# EAGLE design hybrid (EAGLE 8.2.1)

## Sheet 1 of 3
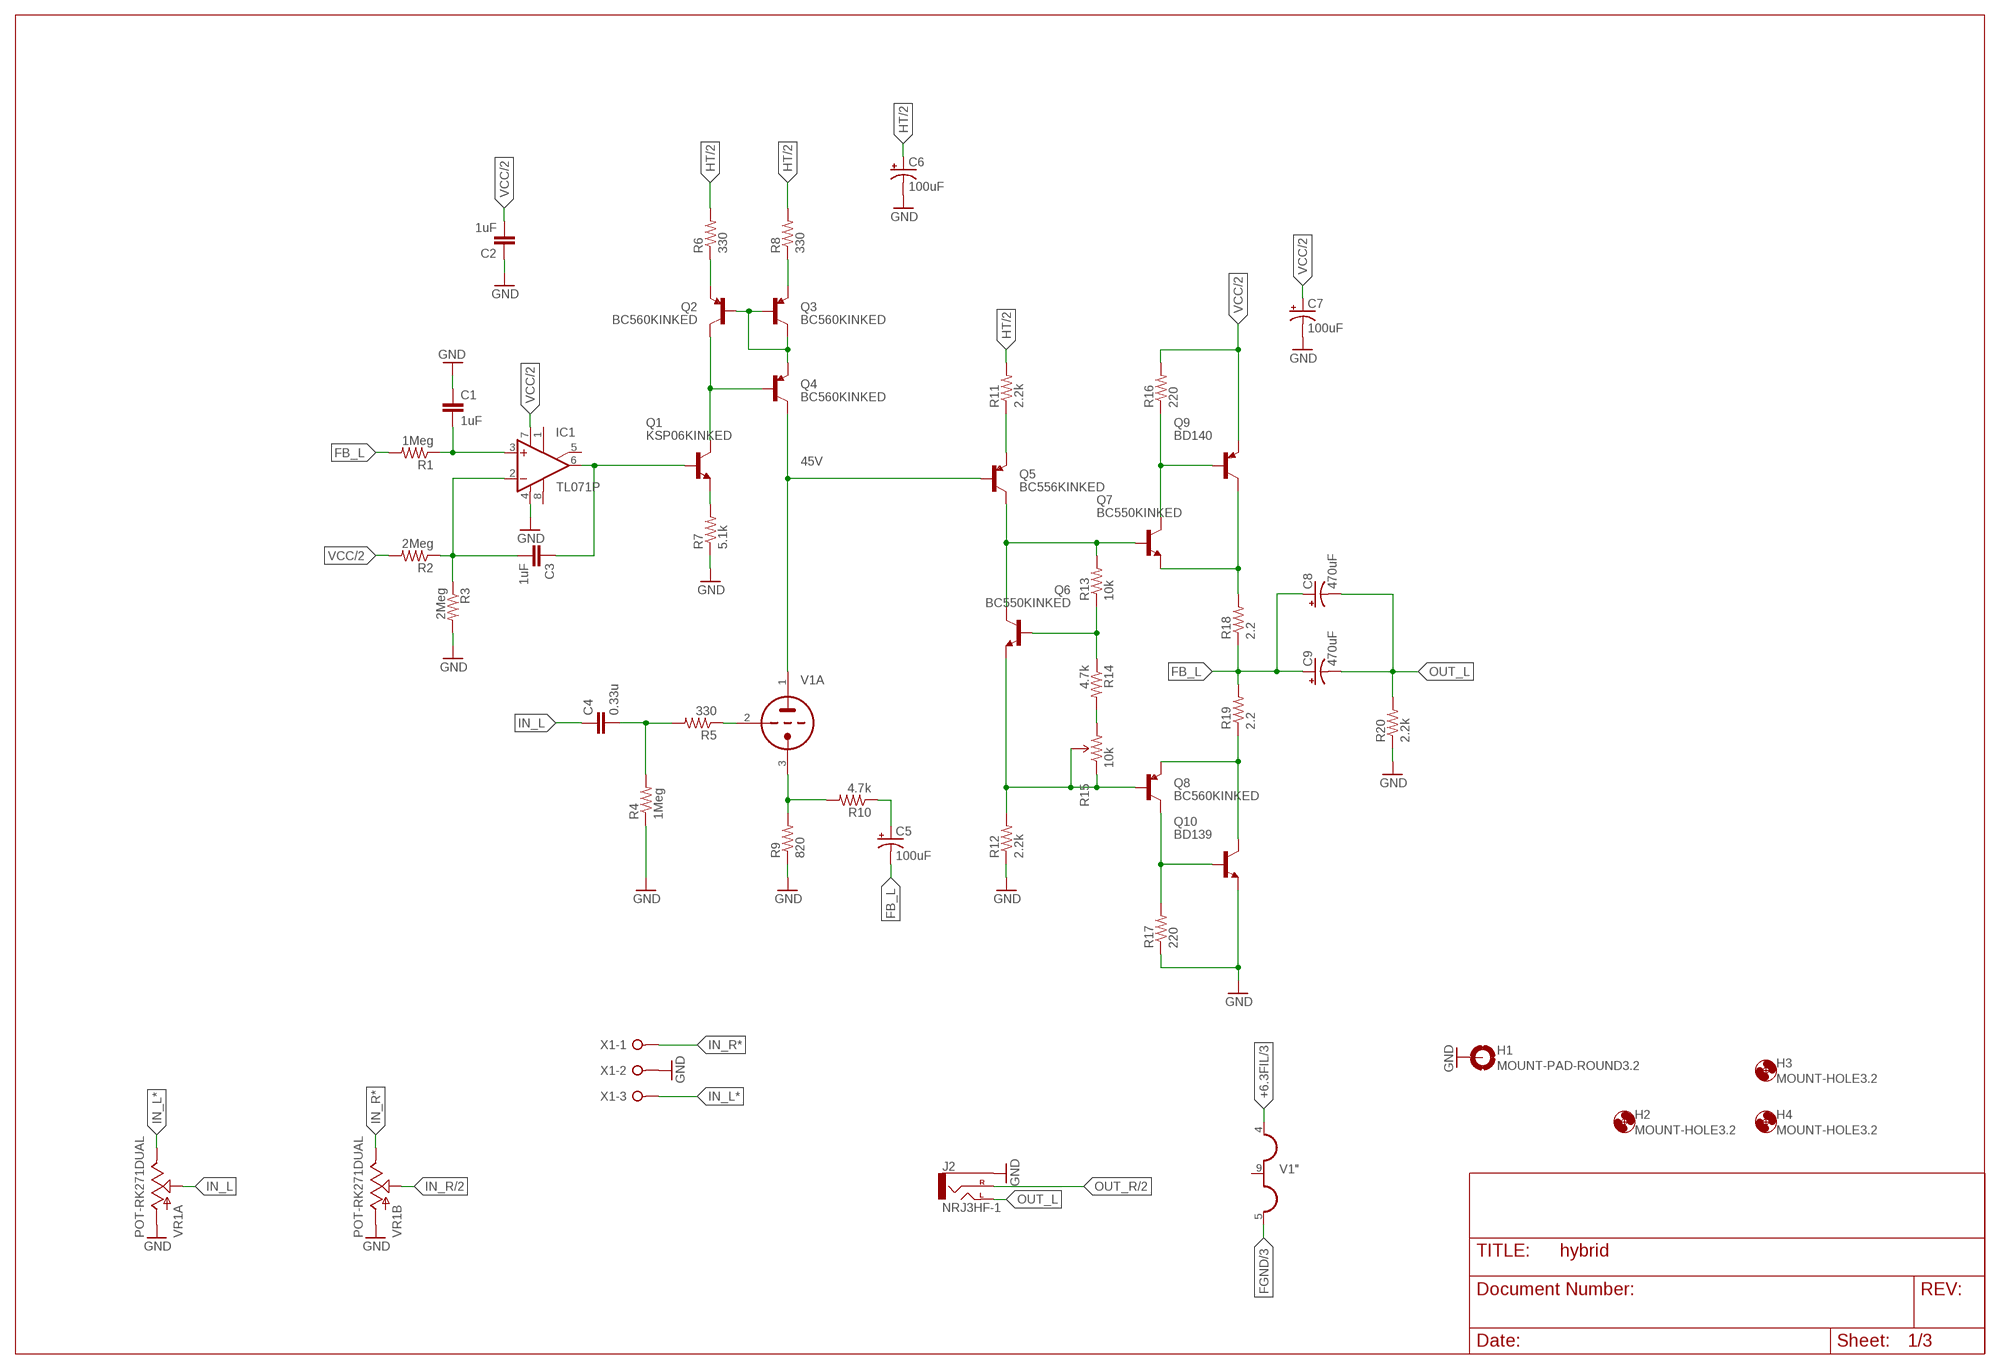
[diagram p0: schematic, sheet 1]

### Parts
C1  1uF  C5/5  [C5B5]
C2  1uF  CAPPTH  [CAP-PTH-SMALL]
C3  1uF  C5/5  [C5B5]
C4  0.33u  C5/7.2  [C5B7.2]
C5  100uF  CAP_POLPTH-8/3.5  [CPOL-RADIAL-8/3.5]
C6  100uF  CAP_POLPTH-12.5/5  [CPOL-RADIAL-12.5/5]
C7  100uF  CAP_POLPTH-12.5/5  [CPOL-RADIAL-12.5/5]
C8  470uF  CAP_POLPTH-12.5/5  [CPOL-RADIAL-12.5/5]
C9  470uF  CAP_POLPTH-12.5/5  [CPOL-RADIAL-12.5/5]
H1  MOUNT-PAD-ROUND3.2  [3,2-PAD]
H2  MOUNT-HOLE3.2  [3,2]
H3  MOUNT-HOLE3.2  [3,2]
H4  MOUNT-HOLE3.2  [3,2]
IC1  TL071P  [DIL08]
J2  NRJ3HF-1  [NRJ3HF]
Q1  KSP06KINKED  [TO92-BENT]
Q2  BC560KINKED  [TO92-BENT]
Q3  BC560KINKED  [TO92-BENT]
Q4  BC560KINKED  [TO92-BENT]
Q5  BC556KINKED  [TO92-BENT]
Q6  BC550KINKED  [TO92-BENT]
Q7  BC550KINKED  [TO92-BENT]
Q8  BC560KINKED  [TO92-BENT]
Q9  BD140  [TO126]
Q10  BD139  [TO126]
R1  1Meg  RESISTORPTH-1/4W  [AXIAL-0.4]
R2  2Meg  RESISTORPTH-1/4W  [AXIAL-0.4]
R3  2Meg  RESISTORPTH-1/4W  [AXIAL-0.4]
R4  1Meg  RESISTORPTH-1/4W  [AXIAL-0.4]
R5  330  RESISTORPTH-1/4W  [AXIAL-0.4]
R6  330  RESISTORPTH-1/4W  [AXIAL-0.4]
R7  5.1k  RESISTORPTH-1/4W  [AXIAL-0.4]
R8  330  RESISTORPTH-1/4W  [AXIAL-0.4]
R9  820  RESISTORPTH-1/4W  [AXIAL-0.4]
R10  4.7k  RESISTORPTH-1/4W  [AXIAL-0.4]
R11  2.2k  RESISTORPTH-1/4W  [AXIAL-0.4]
R12  2.2k  RESISTORPTH-1/4W  [AXIAL-0.4]
R13  10k  RESISTORPTH-1/4W  [AXIAL-0.4]
R14  4.7k  RESISTORPTH-1/4W  [AXIAL-0.4]
R15  10k  TRIMPOT3362U-2  [3362U-2]
R16  220  RESISTORPTH-1/4W  [AXIAL-0.4]
R17  220  RESISTORPTH-1/4W  [AXIAL-0.4]
R18  2.2  RESISTORPTH-1/4W  [AXIAL-0.4]
R19  2.2  RESISTORPTH-1/4W  [AXIAL-0.4]
R20  2.2k  RESISTORPTH-1/4W  [AXIAL-0.4]
V1  6DJ8-P21MM-BASE  [NOVAL-21MM]
VR1  POT-RK271DUAL  [RK271+PTD902]
X1  W237-3E  [W237-3E]

### Nets
+6.3FIL [pwr]: V1.4(":H1) ; also sheet 3
CAT_L: R9.P$2 R10.P$2 V1.3(A:TK)
FB_L [out]: C5.2(-) C8.+ C9.+ R1.P$2 R18.P$1 R19.P$2
FGND [pwr]: V1.5(":H3) ; also sheet 3
G_L: C4.2 R4.P$2 R5.P$2
GND: C1.1 C2.1 C6.- C7.- H1.B3,2(MOUNT) IC1.4(V-) J2.S(SLEEVE) Q10.1(E) R3.P$2 R4.P$1 R7.P$1 R9.P$1 R12.P$1 R17.P$1 R20.P$1 VR1.1.1.1(A:A) VR1.1.1.2(A:A) VR1.2.1.1(B:A) VR1.2.1.2(B:A) X1.2 ; also sheet 2,3
HT [pwr]: C6.+ R6.P$2 R8.P$2 R11.P$2 ; also sheet 2,3
IN_L: C4.1 VR1.1.2(A:S)
IN_L*: VR1.1.3.1(A:E) VR1.1.3.2(A:E) X1.3
IN_R: VR1.2.2.1(B:S) VR1.2.2.2(B:S) ; also sheet 2
IN_R*: VR1.2.3.1(B:E) VR1.2.3.2(B:E) X1.1
ISET_L: Q1.3(C) Q2.1(C) Q4.2(B)
N$1: Q2.2(B) Q3.1(C) Q3.2(B) Q4.3(E)
N$2: Q3.3(E) R8.P$1
N$3: Q2.3(E) R6.P$1
N$4: C5.1(+) R10.P$1
N$5: Q5.3(E) R11.P$1
N$6: R5.P$1 V1.2(A:TG)
N$7: Q5.1(C) Q6.1(C) Q7.2(B) R13.P$2
N$8: Q6.2(B) R13.P$1 R14.P$1
N$10: R14.P$2 R15.3(CW)
N$11 [out]: Q7.3(E) Q9.2(C) R18.P$2
N$12: Q6.3(E) Q8.2(B) R12.P$2 R15.1(CCW) R15.2(WIPER)
N$13 [out]: Q8.3(E) Q10.2(C) R19.P$1
N$14: Q7.1(C) Q9.3(B) R16.P$1
N$15: Q8.1(C) Q10.3(B) R17.P$2
N$29: C3.1 IC1.6(OUT) Q1.2(B)
N$35: C3.2 IC1.2(-IN) R2.P$1 R3.P$1
N$38: C1.2 IC1.3(+IN) R1.P$1
N$47: Q1.1(E) R7.P$2
OUT_L [out]: C8.- C9.- J2.T(LEFT) R20.P$2
OUT_R [out]: J2.R(RIGHT) ; also sheet 2
PL_L: Q4.1(C) Q5.2(B) V1.1(A:TA)
VCC [pwr]: C2.2 C7.+ IC1.7(V+) Q9.1(E) R2.P$2 R16.P$2 ; also sheet 2,3
Unconnected: IC1.1(ON1) IC1.5(ON2) IC1.8(OPT) V1.9(":H2)

### Notes on the sheet
- 45V

## Sheet 2 of 3
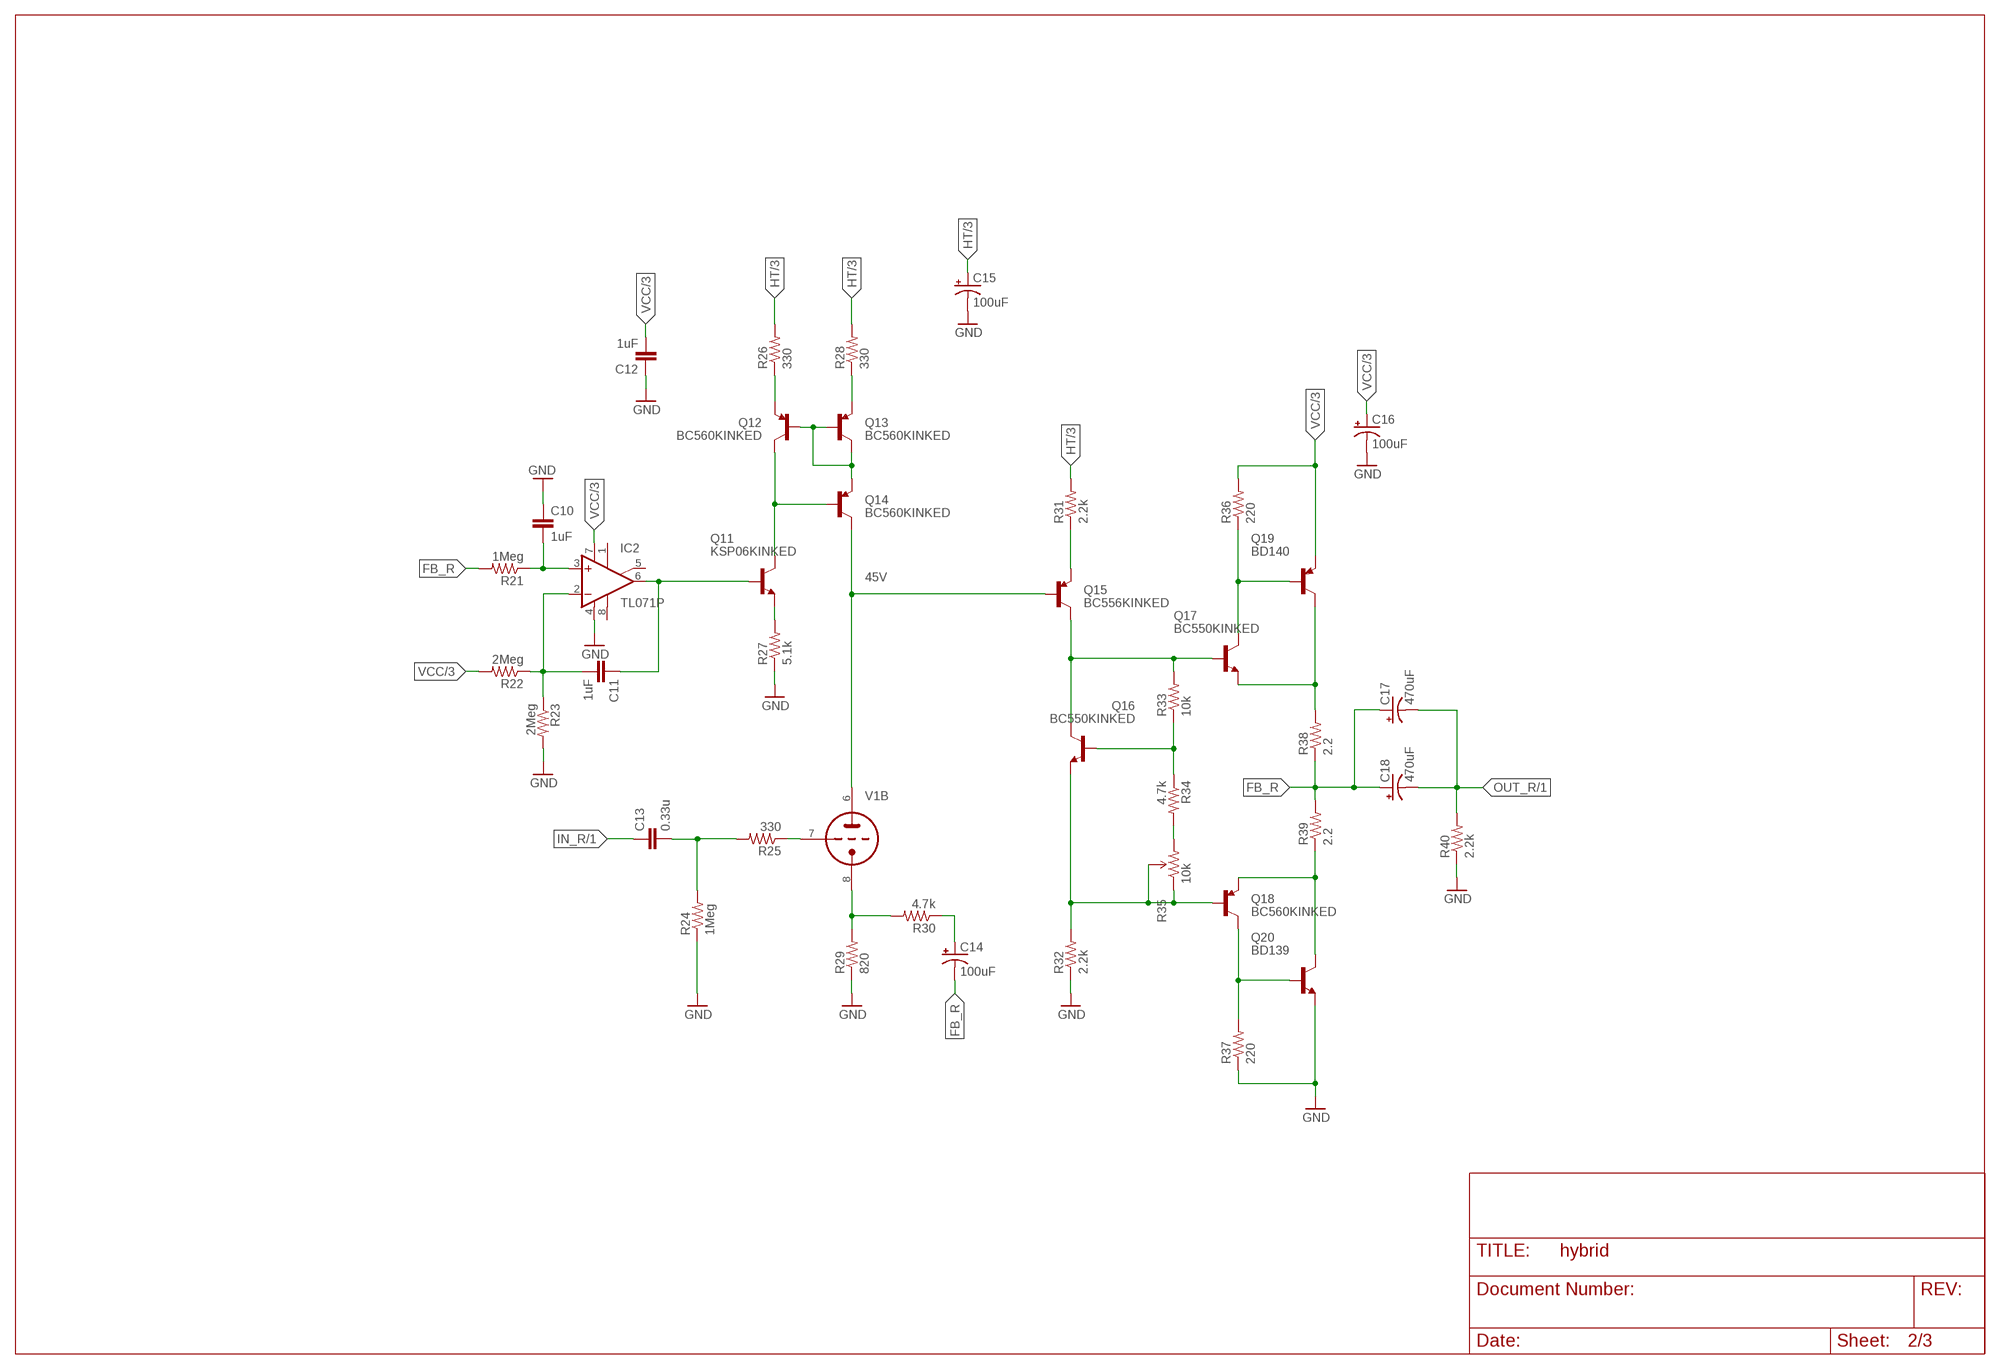
[diagram p1: schematic, sheet 2]

### Parts
C10  1uF  C5/5  [C5B5]
C11  1uF  C5/5  [C5B5]
C12  1uF  CAPPTH  [CAP-PTH-SMALL]
C13  0.33u  C5/7.2  [C5B7.2]
C14  100uF  CAP_POLPTH-8/3.5  [CPOL-RADIAL-8/3.5]
C15  100uF  CAP_POLPTH-12.5/5  [CPOL-RADIAL-12.5/5]
C16  100uF  CAP_POLPTH-12.5/5  [CPOL-RADIAL-12.5/5]
C17  470uF  CAP_POLPTH-12.5/5  [CPOL-RADIAL-12.5/5]
C18  470uF  CAP_POLPTH-12.5/5  [CPOL-RADIAL-12.5/5]
IC2  TL071P  [DIL08]
Q11  KSP06KINKED  [TO92-BENT]
Q12  BC560KINKED  [TO92-BENT]
Q13  BC560KINKED  [TO92-BENT]
Q14  BC560KINKED  [TO92-BENT]
Q15  BC556KINKED  [TO92-BENT]
Q16  BC550KINKED  [TO92-BENT]
Q17  BC550KINKED  [TO92-BENT]
Q18  BC560KINKED  [TO92-BENT]
Q19  BD140  [TO126]
Q20  BD139  [TO126]
R21  1Meg  RESISTORPTH-1/4W  [AXIAL-0.4]
R22  2Meg  RESISTORPTH-1/4W  [AXIAL-0.4]
R23  2Meg  RESISTORPTH-1/4W  [AXIAL-0.4]
R24  1Meg  RESISTORPTH-1/4W  [AXIAL-0.4]
R25  330  RESISTORPTH-1/4W  [AXIAL-0.4]
R26  330  RESISTORPTH-1/4W  [AXIAL-0.4]
R27  5.1k  RESISTORPTH-1/4W  [AXIAL-0.4]
R28  330  RESISTORPTH-1/4W  [AXIAL-0.4]
R29  820  RESISTORPTH-1/4W  [AXIAL-0.4]
R30  4.7k  RESISTORPTH-1/4W  [AXIAL-0.4]
R31  2.2k  RESISTORPTH-1/4W  [AXIAL-0.4]
R32  2.2k  RESISTORPTH-1/4W  [AXIAL-0.4]
R33  10k  RESISTORPTH-1/4W  [AXIAL-0.4]
R34  4.7k  RESISTORPTH-1/4W  [AXIAL-0.4]
R35  10k  TRIMPOT3362U-2  [3362U-2]
R36  220  RESISTORPTH-1/4W  [AXIAL-0.4]
R37  220  RESISTORPTH-1/4W  [AXIAL-0.4]
R38  2.2  RESISTORPTH-1/4W  [AXIAL-0.4]
R39  2.2  RESISTORPTH-1/4W  [AXIAL-0.4]
R40  2.2k  RESISTORPTH-1/4W  [AXIAL-0.4]

### Nets
CAT_R: R29.P$2 R30.P$2 V1.8(B:TK)
FB_R [out]: C14.2(-) C17.+ C18.+ R21.P$2 R38.P$1 R39.P$2
G_R: C13.2 R24.P$2 R25.P$2
GND: C10.1 C12.1 C15.- C16.- IC2.4(V-) Q20.1(E) R23.P$2 R24.P$1 R27.P$1 R29.P$1 R32.P$1 R37.P$1 R40.P$1 ; also sheet 1,3
HT [pwr]: C15.+ R26.P$2 R28.P$2 R31.P$2 ; also sheet 1,3
IN_R: C13.1 ; also sheet 1
ISET_R: Q11.3(C) Q12.1(C) Q14.2(B)
N$9: R25.P$1 V1.7(B:TG)
N$16: Q13.3(E) R28.P$1
N$17: Q12.2(B) Q13.1(C) Q13.2(B) Q14.3(E)
N$19: C14.1(+) R30.P$1
N$20: Q15.3(E) R31.P$1
N$21: Q15.1(C) Q16.1(C) Q17.2(B) R33.P$2
N$22: Q16.2(B) R33.P$1 R34.P$1
N$23: R34.P$2 R35.3(CW)
N$24: Q16.3(E) Q18.2(B) R32.P$2 R35.1(CCW) R35.2(WIPER)
N$25 [out]: Q17.3(E) Q19.2(C) R38.P$2
N$26 [out]: Q18.3(E) Q20.2(C) R39.P$1
N$27: Q17.1(C) Q19.3(B) R36.P$1
N$28: Q18.1(C) Q20.3(B) R37.P$2
N$39: Q12.3(E) R26.P$1
N$41: C11.2 IC2.2(-IN) R22.P$1 R23.P$1
N$42: C10.2 IC2.3(+IN) R21.P$1
N$43: C11.1 IC2.6(OUT) Q11.2(B)
N$48: Q11.1(E) R27.P$2
OUT_R [out]: C17.- C18.- R40.P$2 ; also sheet 1
PL_R: Q14.1(C) Q15.2(B) V1.6(B:TA)
VCC [pwr]: C12.2 C16.+ IC2.7(V+) Q19.1(E) R22.P$2 R36.P$2 ; also sheet 1,3
Unconnected: IC2.1(ON1) IC2.5(ON2) IC2.8(OPT)

### Notes on the sheet
- 45V

## Sheet 3 of 3
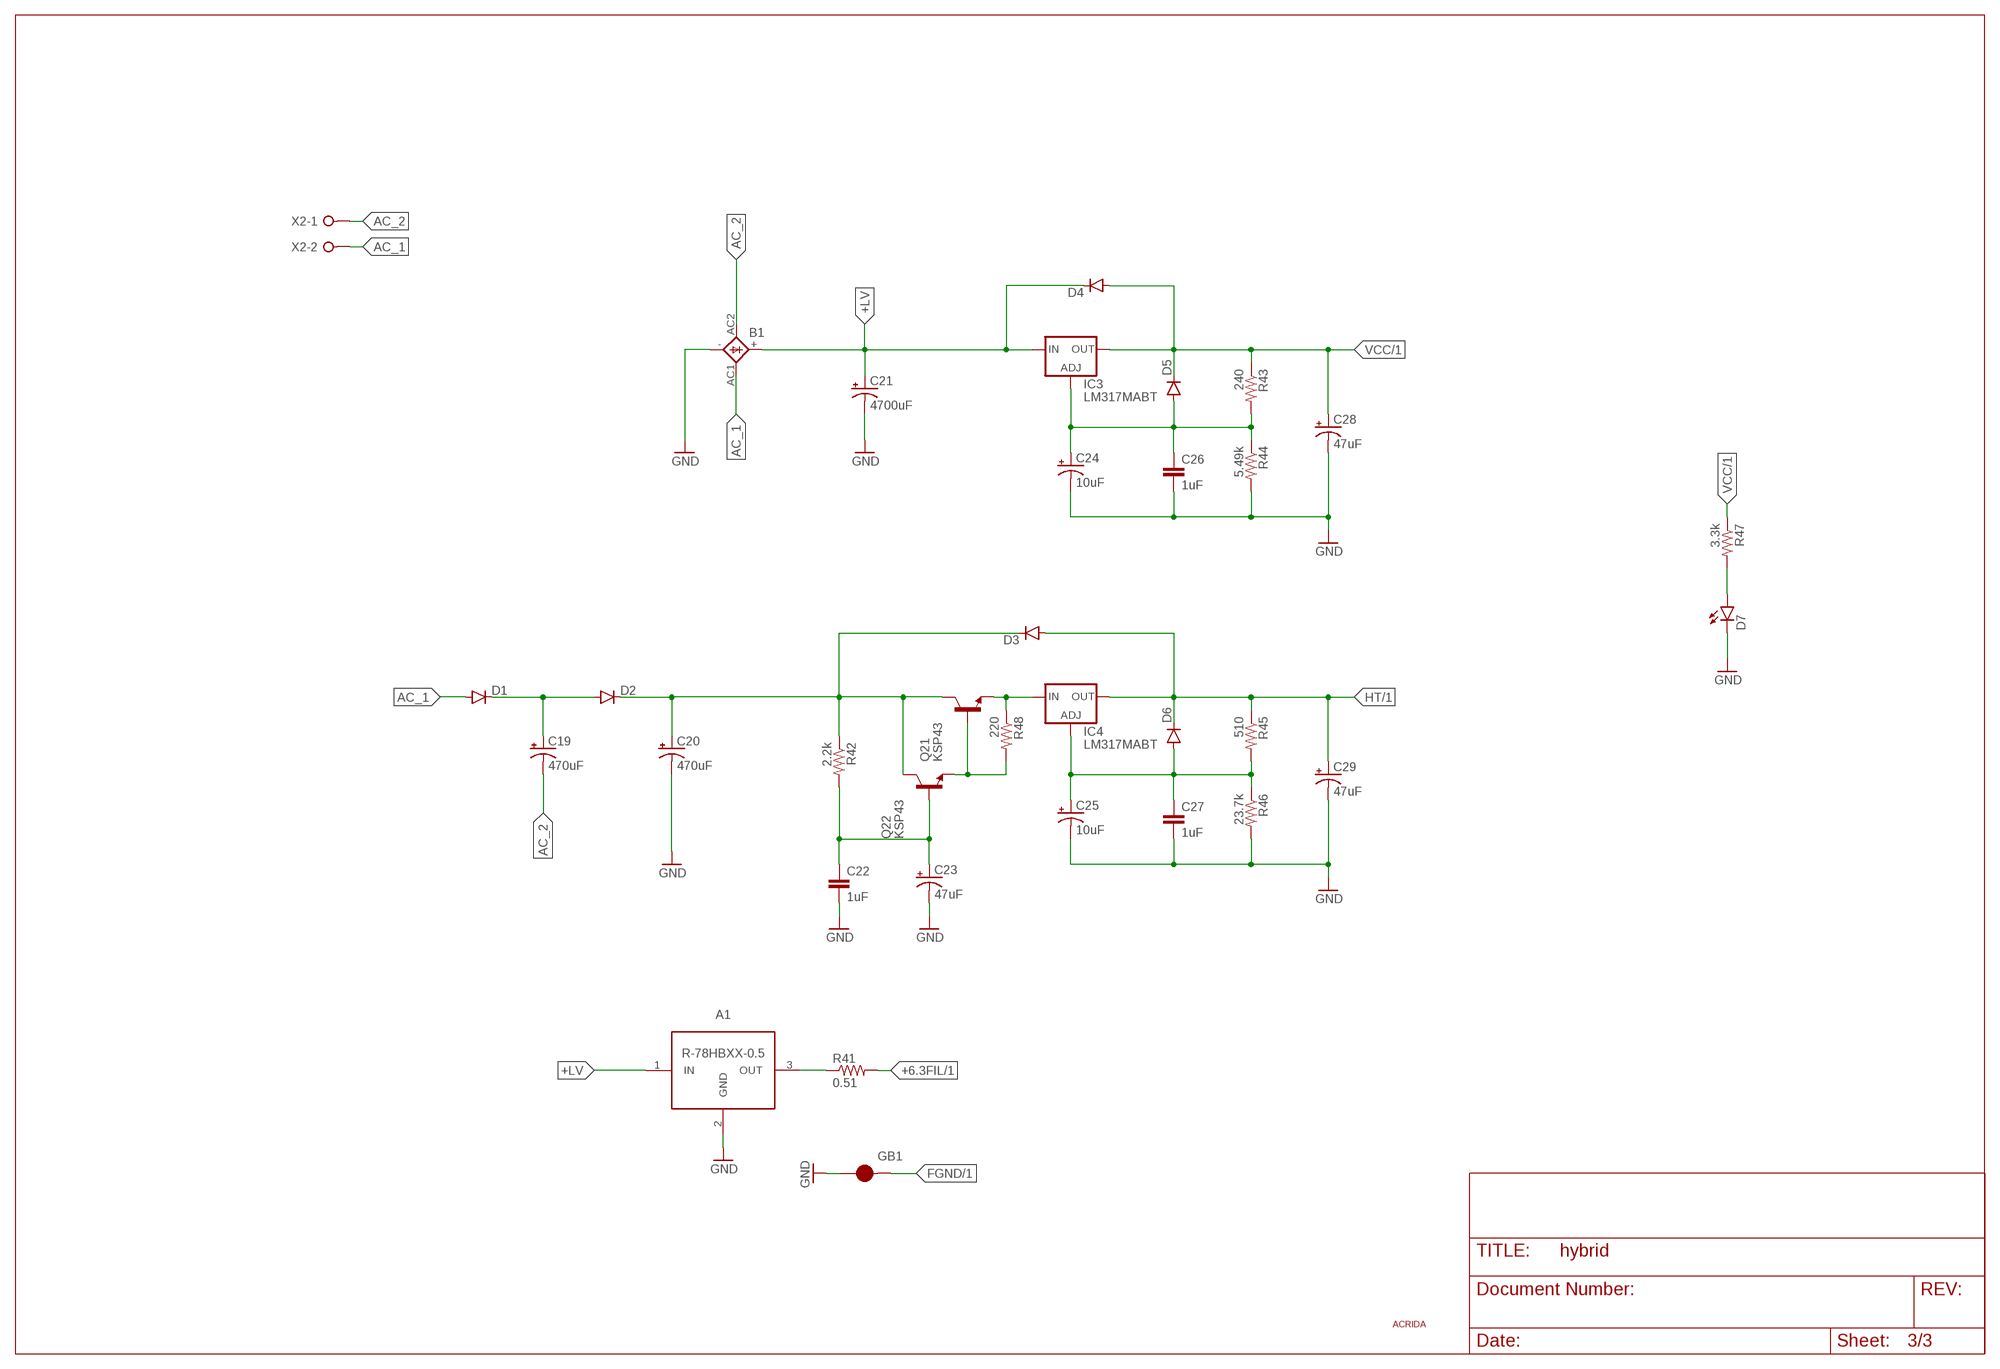
[diagram p2: schematic, sheet 3]

### Parts
A1  R-78HBXX-0.5  [R-78HB]
B1  GBU4  [GBU4S]
C19  470uF  CAP_POLPTH-18/7.5  [CPOL-RADIAL-18/7.5]
C20  470uF  CAP_POLPTH-18/7.5  [CPOL-RADIAL-18/7.5]
C21  4700uF  CAP_POLSNAPIN-30/10  [CPOL-SNAPIN-30/10]
C22  1uF  CAPPTH1  [CAP-PTH-5MM]
C23  47uF  CAP_POLPTH-12/5  [CPOL-RADIAL-12/5]
C24  10uF  CAP_POLPTH-5/2.5  [CPOL-RADIAL-5/2.5]
C25  10uF  CAP_POLPTH-6.5/2.5  [CPOL-RADIAL-6.5/2.5]
C26  1uF  CAPPTH  [CAP-PTH-SMALL]
C27  1uF  CAPPTH  [CAP-PTH-SMALL]
C28  47uF  CAP_POLPTH-8/3.5  [CPOL-RADIAL-8/3.5]
C29  47uF  CAP_POLPTH-8/3.5  [CPOL-RADIAL-8/3.5]
D1  DIODEPTH  [DIODE-1N4001]
D2  DIODEPTH  [DIODE-1N4001]
D3  DIODEPTH  [DIODE-1N4001]
D4  DIODEPTH  [DIODE-1N4001]
D5  DIODEPTH  [DIODE-1N4001]
D6  DIODEPTH  [DIODE-1N4001]
D7  LED3MM  [LED3MM]
GB1  COPPER-BRIDGESM  [COPPER-BRIDGE-SM]
IC3  LM317MABT  [TO220L1]
IC4  LM317MABT  [TO220L1]
LOGO1  ACRIDA-LOGO  [ACRIDA-LOGO]
Q21  KSP43  [TO-92]
Q22  KSP43  [TO-92]
R41  0.51  RESISTORPTH-1/2W  [AXIAL-0.5]
R42  2.2k  RESISTORPTH-1/4W  [AXIAL-0.4]
R43  240  RESISTORPTH-1/4W  [AXIAL-0.4]
R44  5.49k  RESISTORPTH-1/4W  [AXIAL-0.4]
R45  510  RESISTORPTH-1/4W  [AXIAL-0.4]
R46  23.7k  RESISTORPTH-1/4W  [AXIAL-0.4]
R47  3.3k  RESISTORPTH-1/4W  [AXIAL-0.4]
R48  220  RESISTORPTH-1/4W  [AXIAL-0.4]
X2  W237-2N  [W237-2N]

### Nets
+6.3FIL [pwr]: R41.P$2 ; also sheet 1
+LV [pwr]: A1.1(IN) B1.+ C21.1(+) D4.C IC3.3(IN)
AC_1: B1.AC1(AC2) D1.A X2.2
AC_2: B1.AC2(AC1) C19.2(-) X2.1
FGND [pwr]: GB1.2 ; also sheet 1
GND: A1.2(GND) B1.- C20.2(-) C21.2(-) C22.2 C23.- C24.2(-) C25.2(-) C26.2 C27.2 C28.2(-) C29.2(-) D7.K(C) GB1.1 R44.P$2 R46.P$2 ; also sheet 1,2
HT [pwr]: C29.1(+) D3.A D6.C IC4.2(OUT) R45.P$1 ; also sheet 1,2
N$18: Q21.2(B) Q22.1(E) R48.P$2
N$30: C24.1(+) C26.1 D5.A IC3.1(ADJ) R43.P$2 R44.P$1
N$31 [pwr]: C19.1(+) D1.C D2.A
N$32 [pwr]: A1.3(OUT) R41.P$1
N$33 [pwr]: C20.1(+) D2.C D3.C Q21.3(C) Q22.3(C) R42.P$1
N$34: C22.1 C23.+ Q22.2(B) R42.P$2
N$36: C25.1(+) C27.1 D6.A IC4.1(ADJ) R45.P$2 R46.P$1
N$37 [pwr]: IC4.3(IN) Q21.1(E) R48.P$1
N$46: D7.A R47.P$2
VCC [pwr]: C28.1(+) D4.A D5.C IC3.2(OUT) R43.P$1 R47.P$1 ; also sheet 1,2

## Library data of the parts
A1 = my-smps:R-78HBXX-0.5: The R-78HBxx-Series high efficiency, high input voltage switching regulators are ideally suited to replace 78xx linear regulators and are pin compatible. http://www.mouser.com/ds/2/468/R-78HBxx-0.5_L-958370.pdf
B1 = rectifier:GBU4: GENERAL INSTRUMENT RECTIFIER
C1 C3 C4 C10 C11 C13 = capacitor-wima:C: CAPACITOR naming: grid - package width
C2 C12 C22 C26 C27 = SparkFun-Capacitors:CAP: Capacitor Standard 0603 ceramic capacitor, and 0.1" leaded capacitor.
C5-C9 C14-C21 C23-C25 C28 C29 = my-cap:CAP_POL: Capacitor Polarized These are standard SMD and PTH capacitors. Normally 10uF, 47uF, and 100uF in electrolytic and tantalum varieties. Always verify the external diameter of the through hole cap, it varies with capacity, voltage, and manufacturer. The EIA devices should be standard.
D1-D6 = SparkFun-DiscreteSemi:DIODE: Diode These are standard reverse protection diodes and small signal diodes. SMA package can handle up to about 1A. SOD-323 can handle about 200mA. What the SOD-323 package when ordering, there are some mfgs out there that are 5-pin packages.
D7 = SparkFun-LED:LED: LEDs Standard schematic elements and footprints for 5mm, 3mm, 1206, and 0603 sized LEDs. 5mm - Spark Fun Electronics SKU : COM-00529 (and others); PROD_ID: DIO-08794
GB1 = my:COPPER-BRIDGE
H1 = holes:MOUNT-PAD-ROUND: MOUNTING PAD, round
H2-H4 = holes:MOUNT-HOLE: MOUNTING HOLE with drill center marker
IC1 IC2 = linear:TL071: OP AMP
IC3 IC4 = my-reg:LM317?*: 500 mA Adjustable Output Positive Voltage Regulator Source: http://www.onsemi.co.jp .. LM317M-D.PDF
J2 = my-conn:NRJ3HF-1: 1/4" Phone Jack
LOGO1 = my-logo:ACRIDA-LOGO
Q1 Q11 = my-tran:KSP06: NPN Epitaxial Silicon Transistor
Q2-Q4 Q8 Q12-Q14 Q18 = my-tran:BC560
Q5 Q15 = my-tran:BC556
Q6 Q7 Q16 Q17 = my-tran:BC550: NPN Epitaxial Silicon Transistor
Q9 Q19 = transistor-pnp:BD140: PNP Transistor
Q10 Q20 = transistor-npn:BD139*: NPN Transistor
Q21 Q22 = my-tran:KSP43
R1-R14 R16-R34 R36-R40 R42-R48 = SparkFun-Resistors:RESISTOR: Resistor Basic schematic elements and footprints for 0603, 1206, and PTH resistors.
R15 R35 = SparkFun-Electromechanical:TRIMPOT: Various small potentiometers for "set-and-forget" applications
R41 = my-res:RESISTOR: Resistor Basic schematic elements and footprints for 0603, 1206, and PTH resistors.
V1 = my-tubes:6DJ8-P
VR1 = my:POT-RK271: 27mm Size Metal Shaft Type RK271 Series Rotary Potentiometer
X1 = con-wago-508:W237-3E: WAGO SREW CLAMP; OC_FARNELL: unknown; OC_NEWARK: unknown
X2 = con-wago-508:W237-2N: WAGO SREW CLAMP; OC_FARNELL: unknown; OC_NEWARK: unknown

## Net classes
1 out: width 0.813 mm
2 pwr: width 1.27 mm

## Board
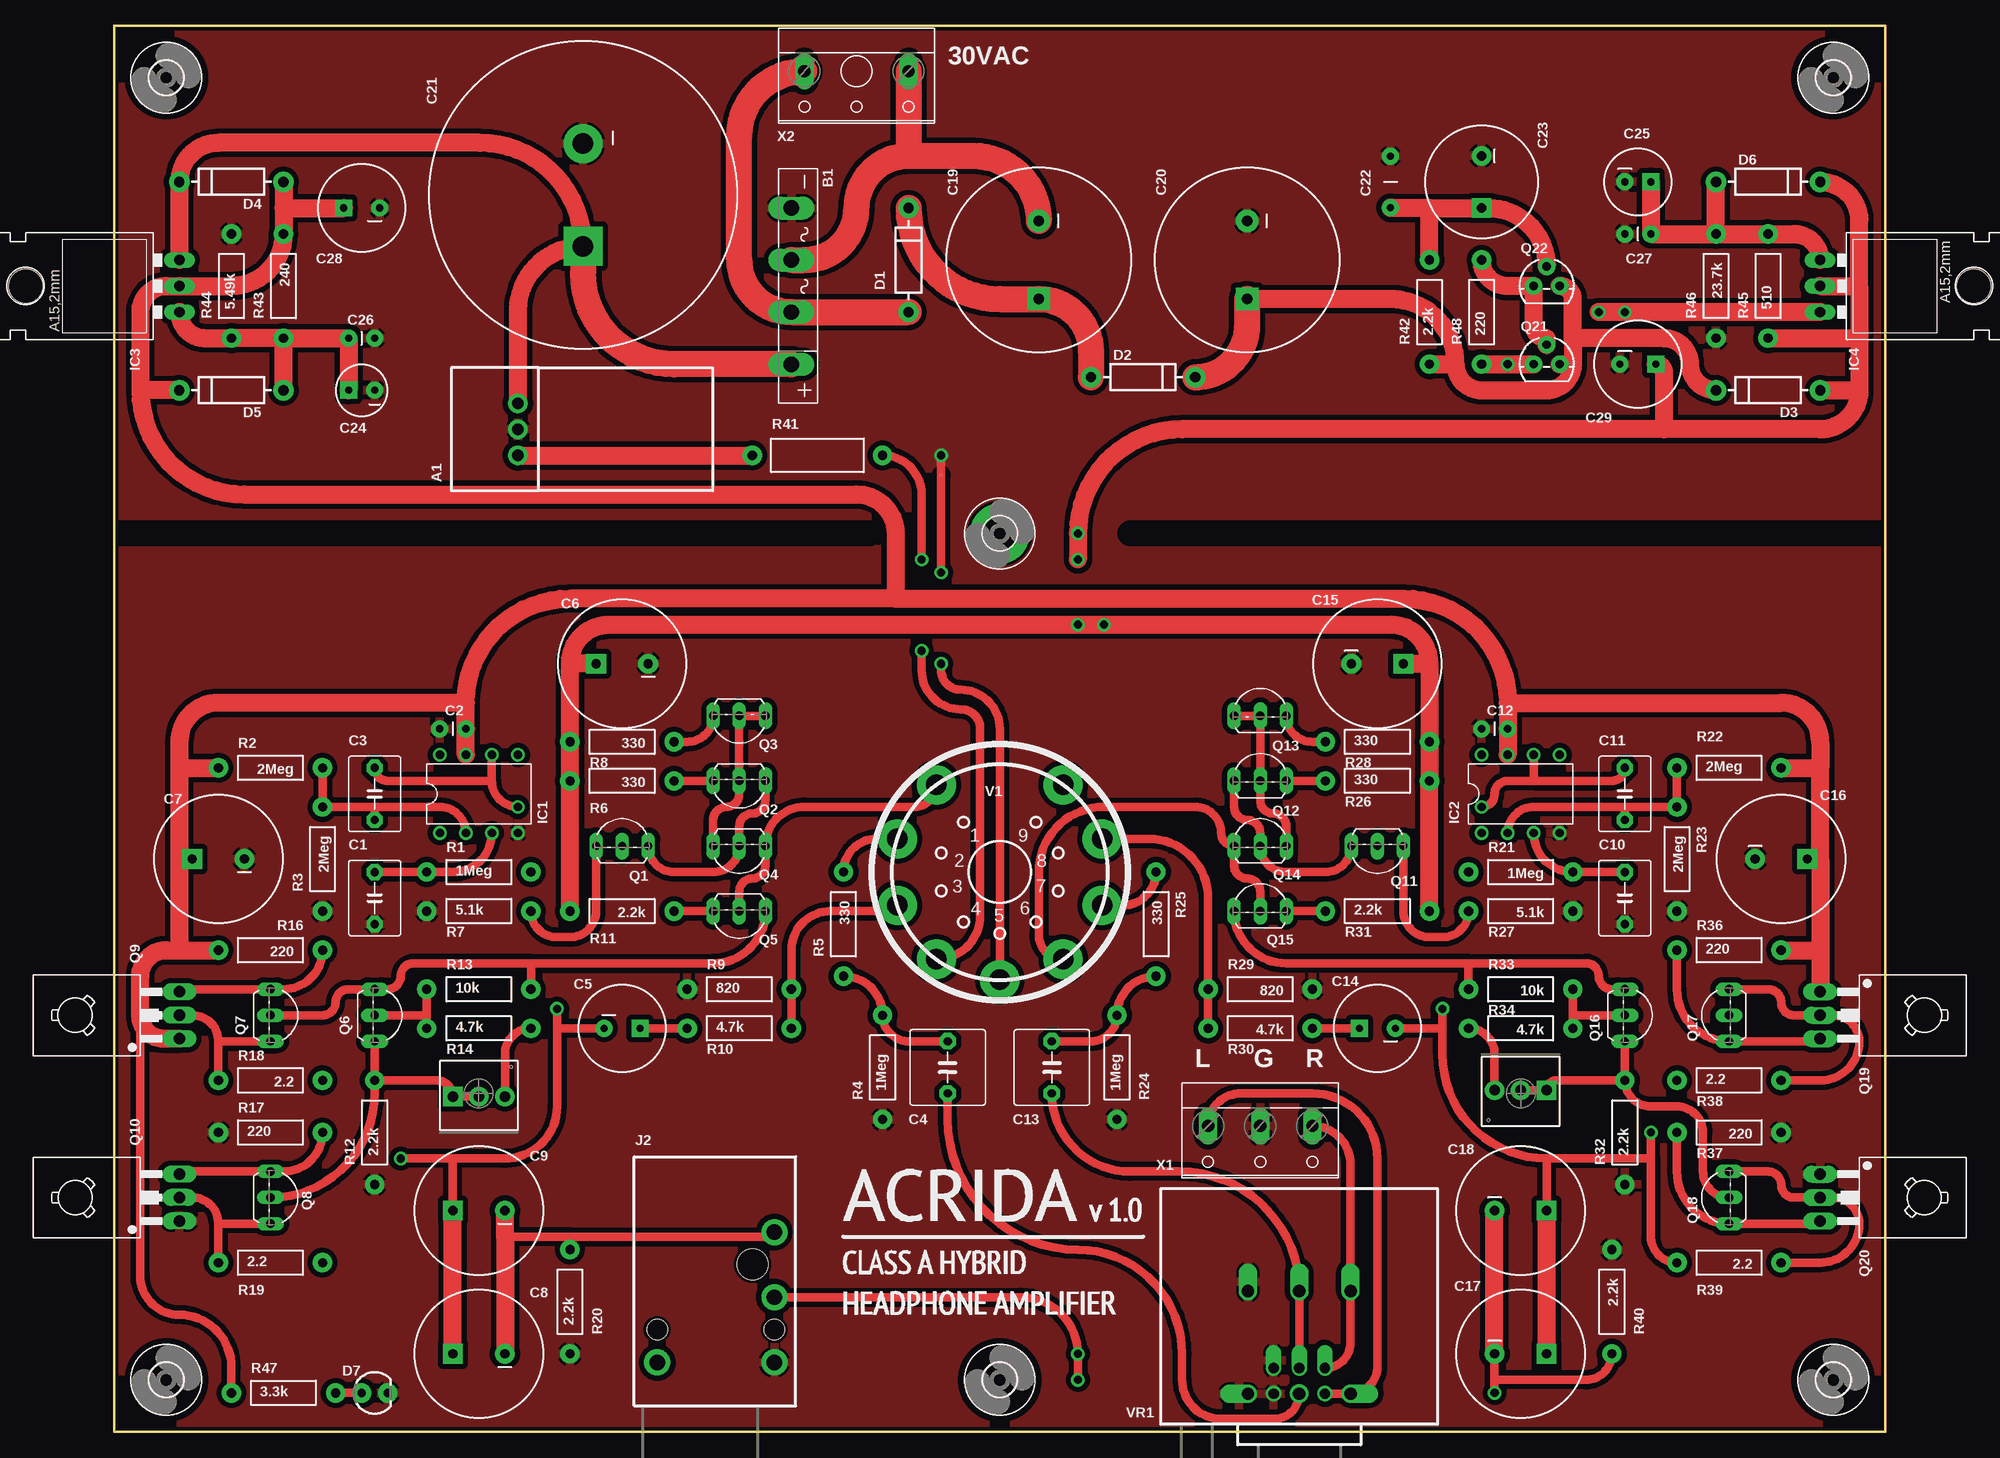
[diagram p3: board, top side]
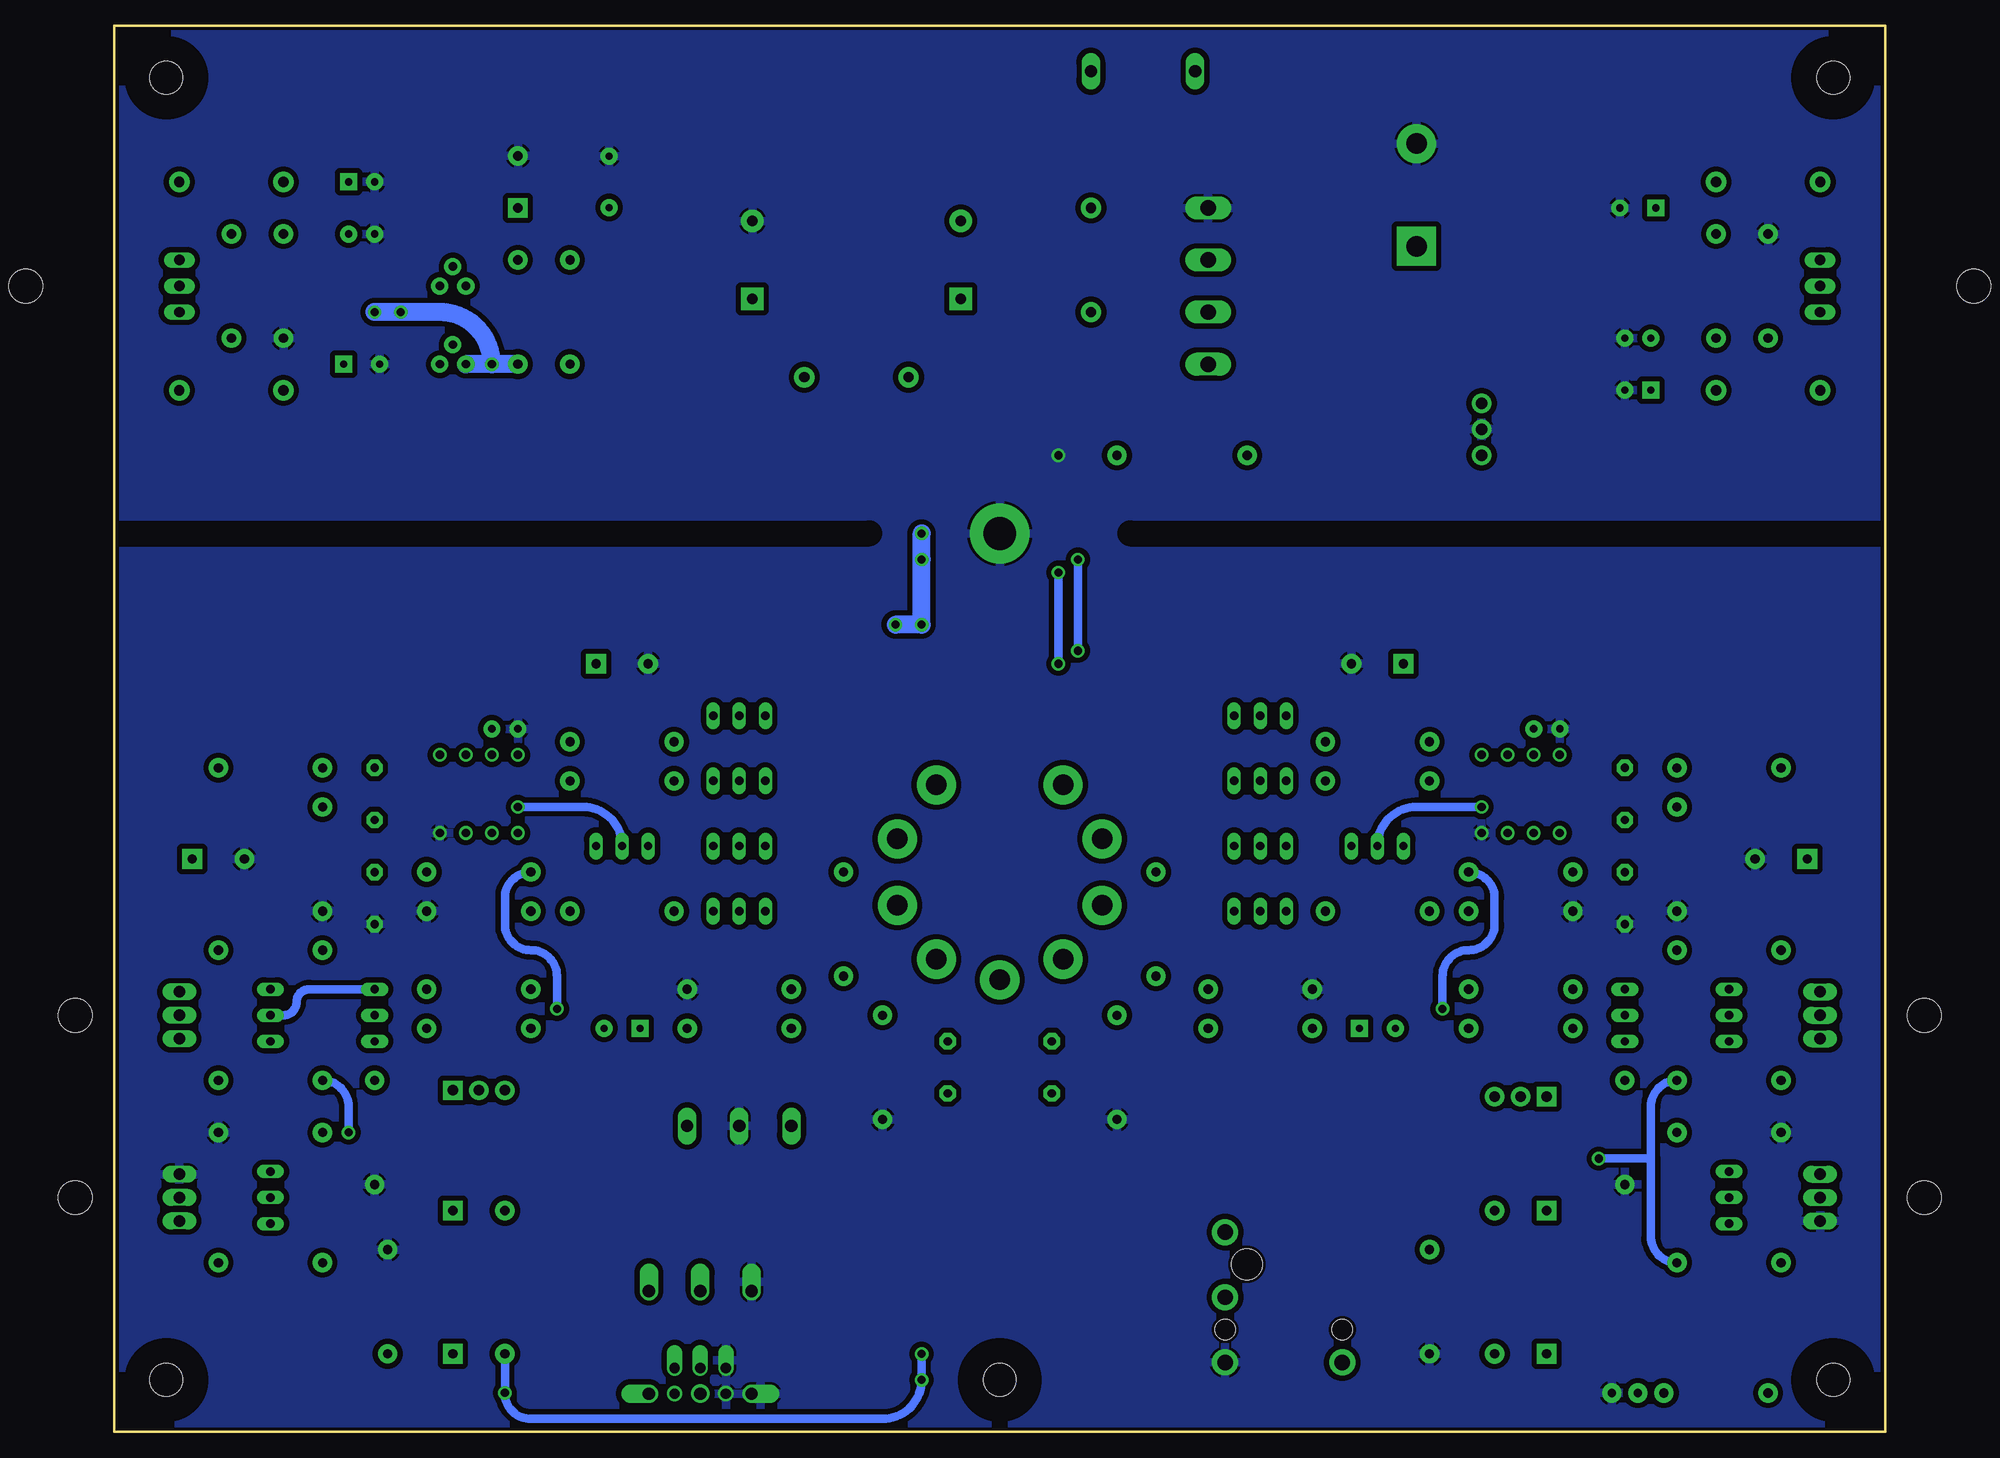
[diagram p4: board, bottom side, seen from below]

Size 172.72 x 137.16 mm. Coordinates in mm from the lower left corner, seen from the top.
Outline: 172.72,137.16 172.72,0 0,0 0,137.16 172.72,137.16
Copper layers (1*16): Top 0.035mm / dielectric 1.5mm / Bottom 0.035mm
Design rules "SeeedStudio_2layer_DRU_no_angle_20140221 *": minimum track width 12mil, minimum drill 12mil, track to track 20mil, track to pad 20mil, pad to pad 20mil, via to via 20mil, smd to smd 0mil, copper to edge 12mil, drill to drill 12mil, minimum pad ring 10mil, minimum via ring 10mil, stop-mask expansion 2mil, vias tented up to drill 100mil, thermal gap 10mil
tRestrict: 2 lines
bRestrict: 2 lines

### Footprints (pad centres in the part's own frame; a part is rotated, then mirrored left to right if it is on the bottom)
R-78HB = drill 1.1 pad 1.93: 1 -2.54,0; 2 0,0; 3 2.54,0
GBU4S = drill 1.499 long: + 7.62,0; - -7.62,0; AC1 2.54,0; AC2 -2.54,0
C5B5 = drill 0.813 pad 1.6 octagon: 1 -2.54,0; 2 2.54,0
CAP-PTH-SMALL = drill 0.7 pad 1.651: 1 0,0; 2 2.54,0
C5B7.2 = drill 0.813 pad 1.6 octagon: 1 -2.54,0; 2 2.54,0
CPOL-RADIAL-8/3.5 = drill 0.7 pad 1.651 square: 1 1.75,0 | drill 0.7 pad 1.651: 2 -1.75,0
CPOL-RADIAL-12.5/5 = drill 0.9 pad 1.93 square: + 2.54,0 | drill 0.9 pad 1.93: - -2.54,0
CPOL-RADIAL-18/7.5 = drill 1.016 pad 2.184 square: 1 3.81,0 | drill 1.016 pad 2.184: 2 -3.81,0
CPOL-SNAPIN-30/10 = drill 2 pad 3.81 square: 1 5,0 | drill 2 pad 3.81: 2 -5,0
CAP-PTH-5MM = drill 0.7 pad 1.651: 1 -2.5,0; 2 2.5,0
CPOL-RADIAL-12/5 = drill 0.9 pad 1.93 square: + 2.54,0 | drill 0.9 pad 1.93: - -2.54,0
CPOL-RADIAL-5/2.5 = drill 0.7 pad 1.651 square: 1 1.27,0 | drill 0.7 pad 1.651: 2 -1.27,0
CPOL-RADIAL-6.5/2.5 = drill 0.7 pad 1.651 square: 1 1.27,0 | drill 0.7 pad 1.651: 2 -1.27,0
DIODE-1N4001 = drill 1 pad 1.981: A -5.08,0; C 5.08,0
LED3MM = drill 0.813 pad 1.88: A -1.27,0; K 1.27,0
COPPER-BRIDGE-SM = smd 0.203 x 0.203: 1 0,0; 2 0,0
3,2-PAD = drill 3.2 pad 5.842: B3,2 0,0
3,2 = hole 3.2: 0,0
DIL08 = drill 0.813 pad 1.27: 1 -3.81,-3.81; 2 -1.27,-3.81; 3 1.27,-3.81; 4 3.81,-3.81; 5 3.81,3.81; 6 1.27,3.81; 7 -1.27,3.81; 8 -3.81,3.81
TO220L1 = drill 1.016 long: 1 -2.54,-3.81; 2 0,-3.81; 3 2.54,-3.81 | hole 3.302: 0,11.176
NRJ3HF = drill 1.5 pad 2.54: G -4.25,-4.2; R -10.6,7.23; S -4.25,7.23; T -16.95,7.23 | hole 2: -7.45,7.23; -7.45,-4.2 | hole 3: -13.8,5.1
TO92-BENT = drill 0.813 long: 1 -2.54,-1.27; 2 0,-1.27; 3 2.54,-1.27
TO126 = drill 1.118 long: 1 -2.286,-5.08; 2 0,-5.08; 3 2.286,-5.08 | hole 3.302: 0,5.08
TO-92 = drill 0.813 pad 1.676: 1 -1.27,0; 2 0,1.905; 3 1.27,0
AXIAL-0.4 = drill 0.9 pad 1.88: P$1 -5.08,0; P$2 5.08,0
3362U-2 = drill 1.016 pad 1.88 square: 1 -2.54,-0.305 | drill 1.016 pad 1.88: 2 0,-0.305; 3 2.54,-0.305
AXIAL-0.5 = drill 0.9 pad 1.88: P$1 -6.35,0; P$2 6.35,0
NOVAL-21MM = drill 2 pad 3.81: 1 6.172,-8.495; 2 9.986,-3.245; 3 9.986,3.245; 4 6.172,8.495; 5 0,10.5; 6 -6.172,8.495; 7 -9.986,3.245; 8 -9.986,-3.245; 9 -6.172,-8.495
RK271+PTD902 = drill 1.2 offset: 1.1.1 -5,-5; 1.3.1 -5,5; 2.1.1 -15,-5; 2.2.1 -15,0; 2.3.1 -15,5 | drill 1: 1.1.2 -5,-2.5; 1.3.2 -5,2.5 | drill 1.2: 1.2 -5,0 | drill 1 offset: 2.1.2 -7.5,-2.5; 2.2.2 -7.5,0; 2.3.2 -7.5,2.5
W237-3E = drill 1.194 long: 1 -5.08,-0.635; 2 0,-0.635; 3 5.08,-0.635
W237-2N = drill 1.194 long: 1 -5.08,-0.635; 2 5.08,-0.635

### Placement (x,y rotation side)
A1  39.37,97.79 270 top
B1  66.04,111.76 270 top
C1  25.4,52.07 90 top
C2  31.75,68.58 0 top
C3  25.4,62.23 270 top
C4  81.28,35.56 90 top
C5  49.53,39.37 0 top
C6  49.53,74.93 180 top
C7  10.16,55.88 180 top
C8  35.56,7.62 180 top
C9  35.56,21.59 180 top
C10  147.32,52.07 90 top
C11  147.32,62.23 270 top
C12  133.35,68.58 0 top
C13  91.44,35.56 90 top
C14  123.19,39.37 180 top
C15  123.19,74.93 0 top
C16  162.56,55.88 0 top
C17  137.16,7.62 0 top
C18  137.16,21.59 0 top
C19  90.17,114.3 270 top
C20  110.49,114.3 270 top
C21  45.72,120.65 270 top
C22  124.46,121.92 90 top
C23  133.35,121.92 270 top
C24  24.13,101.6 180 top
C25  148.59,121.92 0 top
C26  22.86,106.68 0 top
C27  149.86,116.84 180 top
C28  24.13,119.38 180 top
C29  148.59,104.14 0 top
D1  77.47,114.3 90 top
D2  100.33,102.87 0 top
D3  161.29,101.6 180 top
D4  11.43,121.92 180 top
D5  11.43,101.6 180 top
D6  161.29,121.92 0 top
D7  25.4,3.81 0 top
GB1  80.64,93.34 0 top
H1  86.36,87.63 0 top
H2  86.36,5.08 0 top
H3  167.64,5.08 0 top
H4  5.08,5.08 0 top
H5  MOUNT-HOLE3.2  [3,2]  5.08,132.08 0 top
H6  MOUNT-HOLE3.2  [3,2]  167.64,132.08 0 top
IC1  35.56,62.23 0 top
IC2  137.16,62.23 0 top
IC3  2.54,111.76 90 top
IC4  170.18,111.76 270 top
J2  57.15,2.54 270 top
LOGO1  71.12,11.43 0 top
Q1  49.53,58.42 0 top
Q2  60.96,62.23 180 top
Q3  60.96,68.58 180 top
Q4  60.96,55.88 180 top
Q5  60.96,49.53 180 top
Q6  26.67,40.64 270 top
Q7  16.51,40.64 270 top
Q8  16.51,22.86 270 top
Q9  1.27,40.64 90 top
Q10  1.27,22.86 90 top
Q11  123.19,55.88 180 top
Q12  111.76,64.77 0 top
Q13  111.76,71.12 0 top
Q14  111.76,58.42 0 top
Q15  111.76,52.07 0 top
Q16  148.59,40.64 270 top
Q17  156.21,40.64 90 top
Q18  156.21,22.86 90 top
Q19  171.45,40.64 270 top
Q20  171.45,22.86 270 top
Q21  139.7,104.14 0 top
Q22  139.7,111.76 0 top
R1  35.56,54.61 0 top
R2  15.24,64.77 180 top
R3  20.32,55.88 270 top
R4  74.93,35.56 90 top
R5  71.12,49.53 270 top
R6  49.53,63.5 180 top
R7  35.56,50.8 0 top
R8  49.53,67.31 180 top
R9  60.96,43.18 0 top
R10  60.96,39.37 0 top
R11  49.53,50.8 180 top
R12  25.4,29.21 90 top
R13  35.56,43.18 0 top
R14  35.56,39.37 0 top
R15  35.56,33.02 0 top
R16  15.24,46.99 180 top
R17  15.24,29.21 0 top
R18  15.24,34.29 180 top
R19  15.24,16.51 0 top
R20  44.45,12.7 90 top
R21  137.16,54.61 180 top
R22  157.48,64.77 0 top
R23  152.4,55.88 270 top
R24  97.79,35.56 90 top
R25  101.6,49.53 270 top
R26  123.19,63.5 0 top
R27  137.16,50.8 180 top
R28  123.19,67.31 0 top
R29  111.76,43.18 180 top
R30  111.76,39.37 180 top
R31  123.19,50.8 0 top
R32  147.32,29.21 90 top
R33  137.16,43.18 180 top
R34  137.16,39.37 180 top
R35  137.16,33.02 180 top
R36  157.48,46.99 0 top
R37  157.48,29.21 180 top
R38  157.48,34.29 0 top
R39  157.48,16.51 180 top
R40  146.05,12.7 270 top
R41  68.58,95.25 0 top
R42  128.27,109.22 90 top
R43  16.51,111.76 270 top
R44  11.43,111.76 90 top
R45  161.29,111.76 90 top
R46  156.21,111.76 270 top
R47  16.51,3.81 0 top
R48  133.35,109.22 90 top
V1  86.36,54.61 180 top
VR1  115.57,-1.27 270 top
X1  111.76,29.21 180 top
X2  72.39,132.08 180 top

### Tracks (layer width: path | path; a pad name or v marks a point on that pad's centre or on a via)
+6.3FIL  (via drill 0.8)
  Top 0.813: v78.74,85.09 78.74,91.44 arc90 R41.P$2 | V1.4 arc90 84.45,50.38 84.45,68.58 arc90 82.55,70.48 arc-90 78.74,74.3 v78.74,76.2
  Bottom 0.813: v78.74,76.2 v78.74,85.09
+LV
  Top 1.778: IC3.3 D4.C arc-90 10.16,125.73 35.64,125.73 arc-90 C21.1 arc90 39.37,109.3 A1.1
  Top 2.54: B1.+ 54.61,104.14 arc-90 45.72,113.03 C21.1
AC_1
  Top 2.54: X2.2 arc90 60.96,126.36 60.96,114.3 arc90 B1.AC1 D1.A
AC_2
  Top 2.54: B1.AC2 67.31,114.3 arc90 72.39,119.38 arc-90 77.47,124.46 | 77.47,124.46 83.82,124.46 arc-90 C19.2 | X2.1 77.47,124.46
CAT_L
  Top 0.813: V1.3 arc-90 75.81,50.8 69.85,50.8 arc90 66.04,46.99 R9.P$2 R10.P$2
CAT_R
  Top 0.813: R30.P$2 R29.P$2 106.68,52.07 arc90 100.89,57.85 V1.8
FB_L  (via drill 0.8)
  Top 0.813: 43.18,39.37 v43.18,41.27 | 43.18,39.37 43.18,31.75 arc-90 38.1,26.67 33.02,26.67 | C9.+ 33.02,26.67 | 33.02,26.67 v27.94,26.67 | C5.2 43.18,39.37
  Top 1.778: C8.+ C9.+
  Bottom 0.813: R18.P$1 arc-90 22.86,31.75 22.86,26.67 | 22.86,26.67 22.86,19.05 arc-90 R19.P$2 | v43.18,41.27 43.18,44.45 arc90 40.64,46.99 arc-90 38.1,49.53 38.1,52.07 arc-90 R1.P$2 | 22.86,26.67 v27.94,26.67
FB_R  (via drill 0.8)
  Top 0.813: 139.7,26.67 arc-90 129.54,36.83 129.54,39.37 | 129.54,39.37 C14.2 | C18.+ 139.7,26.67 | R39.P$2 arc-90 149.86,19.05 149.86,26.67 | 149.86,26.67 v149.86,29.21 | 139.7,26.67 149.86,26.67 | 129.54,39.37 v129.54,41.27
  Top 1.778: C17.+ C18.+
  Bottom 0.813: v149.86,29.21 149.86,31.75 arc-90 R38.P$1 | v129.54,41.27 129.54,44.45 arc-90 132.08,46.99 arc90 134.62,49.53 134.62,52.07 arc90 R21.P$2
FGND  (via drill 0.8)
  Top 0.813: V1.5 86.36,68.58 arc90 82.55,72.39 arc-90 80.64,74.3 v80.64,74.93 | v80.64,83.82 GB1.2
  Bottom 0.813: v80.64,74.93 v80.64,83.82
G_L
  Top 0.813: C4.2 77.47,38.1 arc-90 R4.P$2 arc90 R5.P$2
G_R
  Top 0.813: C13.2 95.25,38.1 arc90 R24.P$2 arc-90 R25.P$2
GND  (via drill 0.8)
  Top 0.813: GB1.1 v80.64,95.25
  pour Bottom: 0,137.16 172.72,137.16 172.72,0 0,0
  pour Top (rank 2): 0,137.16 0,0 172.72,0 172.72,137.16
HT  (via drill 0.8)
  Top 1.778: R11.P$2 R6.P$2 R8.P$2 44.45,74.93 | R31.P$2 R26.P$2 R28.P$2 128.27,74.93 | 44.45,74.93 arc-90 48.26,78.74 v93.98,78.74 124.46,78.74 arc-90 128.27,74.93 | C15.+ 128.27,74.93 | C6.+ 44.45,74.93 | D6.C arc-90 170.18,118.11 170.18,111.76 | 170.18,101.6 arc-90 166.37,97.79 151.13,97.79 | 170.18,111.76 170.18,106.68 | 170.18,106.68 170.18,101.6 | C29.1 arc-90 151.13,103.35 151.13,97.79 | D3.A 170.18,101.6 | R45.P$1 170.18,106.68 | IC4.2 170.18,111.76 | v93.98,85.09 v93.98,87.63 arc-90 104.14,97.79 151.13,97.79
  Bottom 1.778: v96.52,78.74 v93.98,78.74 v93.98,85.09 v93.98,87.63
IN_L
  Top 0.813: VR1.1.2 arc-90 113.11,1.27 107.95,1.27 arc-90 104.14,5.08 104.14,7.62 arc90 93.98,17.78 arc-90 81.28,30.48 C4.1
IN_L*
  Top 0.813: VR1.1.3.2 VR1.1.3.1 arc90 123.19,6.35 123.19,26.67 arc90 116.84,33.02 109.86,33.02 arc90 X1.3
IN_R
  Top 0.813: VR1.2.2.2 VR1.2.2.1 | VR1.2.2.1 115.57,13.97 | VR1.2.2.1 arc90 103.9,25.4 99.06,25.4 arc-90 C13.1
IN_R*
  Top 0.813: VR1.2.3.2 arc90 120.57,8.73 VR1.2.3.1 120.57,26.11 arc90 X1.1
ISET_L
  Top 0.813: Q2.1 63.5,61.59 arc-90 62.23,60.33 arc90 60.96,59.05 Q4.2 arc-90 58.42,54.61 54.61,54.61 arc-90 Q1.3
ISET_R
  Top 0.813: Q11.3 arc-90 118.11,54.61 114.3,54.61 arc-90 Q14.2 111.76,58.42 arc90 110.49,59.69 arc-90 109.22,60.96 Q12.1
N$1
  Top 0.813: Q3.1 Q3.2 Q2.2 60.96,62.23 arc-90 59.69,60.96 arc90 58.42,59.69 Q4.3
N$2
  Top 0.813: R8.P$1 55.88,67.31 arc90 Q3.3
N$3
  Top 0.813: Q2.3 R6.P$1
N$4
  Top 0.813: C5.1 R10.P$1
N$5
  Top 0.813: R11.P$1 Q5.3
N$6
  Top 0.813: R5.P$1 arc-90 74.36,57.85 V1.2
N$7
  Top 0.813: Q7.2 20.32,40.64 arc90 21.59,41.91 arc-90 22.86,43.18 Q6.1 26.67,43.18 arc90 27.94,44.45 arc-90 29.21,45.72 40.64,45.72 | Q5.1 arc-90 58.42,45.72 40.64,45.72 | R13.P$2 40.64,45.72
N$8
  Top 0.813: 30.48,40.64 R14.P$1 | 30.48,40.64 R13.P$1 | Q6.2 30.48,40.64
N$9
  Top 0.813: V1.7 98.36,51.37 arc90 R25.P$1
N$10
  Top 0.813: R14.P$2 arc90 38.1,36.83 R15.3
N$11
  Top 0.813: 10.16,38.1 R18.P$2 | 10.16,38.1 Q7.3 | Q9.2 7.62,40.64 arc-90 10.16,38.1
N$12
  Top 0.813: R15.2 R15.1 arc90 31.45,34.29 R12.P$2 | Q6.3 R12.P$2 | Q8.2 arc90 25.4,33.02 R12.P$2
N$13
  Top 0.813: Q10.2 7.62,22.86 arc-90 10.16,20.32 | 10.16,20.32 R19.P$1 | Q8.3 10.16,20.32
N$14
  Top 0.813: Q9.3 arc-90 6.6,43.18 Q7.1 16.51,43.18 arc90 R16.P$1
N$15
  Top 0.813: R17.P$2 arc-90 16.51,25.4 Q8.1 6.6,25.4 arc90 Q10.3
N$16
  Top 0.813: R28.P$1 116.84,67.31 arc-90 Q13.3
N$17
  Top 0.813: Q14.3 114.3,59.05 arc90 113.03,60.33 arc-90 111.76,61.59 Q12.2 Q13.2 Q13.1
N$18
  Top 1.778: R48.P$2 arc90 135.89,111.76 Q22.1 138.43,107.95 arc90 139.7,106.68 Q21.2
N$19
  Top 0.813: C14.1 R30.P$1
N$20
  Top 0.813: R31.P$1 Q15.3
N$21
  Top 0.813: Q15.1 arc90 114.3,45.72 132.08,45.72 | Q16.1 146.05,43.18 arc-90 144.78,44.45 arc90 143.51,45.72 132.08,45.72 | R33.P$2 132.08,45.72
  Bottom 0.813: Q17.2 156.21,40.64 arc-90 154.94,41.91 arc90 153.67,43.18 Q16.1
N$22
  Top 0.813: 142.24,40.64 R34.P$1 | 142.24,40.64 R33.P$1 | Q16.2 142.24,40.64
N$23
  Top 0.813: R35.3 134.62,36.83 arc90 R34.P$2
N$24
  Top 0.813: R32.P$2 Q16.3 | R35.2 R35.1 arc-90 140.66,34.29 R32.P$2 | Q18.2 arc-90 154.94,25.4 154.94,29.21 arc90 152.4,31.75 149.86,31.75 arc-90 R32.P$2
N$25
  Top 0.813: R38.P$2 166.37,34.29 arc90 170.18,38.1 arc90 167.64,40.64 Q19.2 163.83,40.64 arc-90 162.56,41.91 arc90 161.29,43.18 Q17.3
N$26
  Top 0.813: Q18.3 161.29,25.4 arc-90 162.56,24.13 arc90 163.83,22.86 Q20.2 167.64,22.86 arc-90 170.18,20.32 arc-90 166.37,16.51 R39.P$1
N$27
  Top 0.813: Q19.3 arc-90 166.12,38.1 Q17.1 arc-90 152.4,43.18 R36.P$1
N$28
  Top 0.813: Q20.3 arc-90 166.12,20.32 Q18.1 arc-90 152.4,25.4 R37.P$2
N$29  (via drill 0.8)
  Top 0.813: C3.1 arc90 26.67,63.5 36.83,63.5 | 36.83,63.5 IC1.6 | v39.37,60.96 arc-90 36.83,63.5
  Bottom 0.813: Q1.2 arc90 45.72,60.96 v39.37,60.96
N$30
  Top 1.778: IC3.1 arc90 8.89,106.68 R44.P$1 R43.P$2 | R43.P$2 C26.1 C24.1 | D5.A R43.P$2
N$31
  Top 2.54: D1.C arc90 86.36,110.49 C19.1 arc-90 95.25,105.41 D2.A
N$32
  Top 1.778: A1.3 R41.P$1
N$33
  Top 1.778: 130.81,104.14 arc90 133.35,101.6 139.7,101.6 arc90 142.24,104.14 | 130.81,104.14 arc90 124.46,110.49 C20.1 | R42.P$1 130.81,104.14 | 142.24,106.68 142.24,104.14 | 142.24,106.68 142.24,110.49 arc90 Q22.3 | Q21.3 142.24,104.14 | D3.C arc-90 153.67,104.14 arc90 151.13,106.68 142.24,106.68
  Top 2.54: D2.C arc90 110.49,107.95 C20.1
N$34
  Top 1.778: C22.1 arc90 124.5,119.38 128.27,119.38 | 128.27,119.38 C23.+ 133.99,119.38 arc-90 Q22.2 | R42.P$2 128.27,119.38
N$35
  Top 0.813: R2.P$1 R3.P$1 25.4,60.96 | 25.4,60.96 31.75,60.96 arc-90 IC1.2 | C3.2 25.4,60.96
N$36
  Top 1.778: C25.1 C27.1 R46.P$1 | R46.P$1 R45.P$2 163.83,116.84 arc-90 IC4.1 | R46.P$1 D6.A
N$37  (via drill 0.8)
  Top 1.778: R48.P$1 Q21.1 | IC4.3 v144.78,109.22
  Bottom 1.778: v135.89,104.14 arc-90 140.97,109.22 v144.78,109.22 v147.32,109.22 | v135.89,104.14 Q21.1 | R48.P$1 v135.89,104.14
N$38
  Top 0.813: C1.2 R1.P$1 33.02,54.61 arc90 IC1.3
N$39
  Top 0.813: R26.P$1 Q12.3
N$41
  Top 0.813: IC2.2 arc-90 138.43,60.96 147.32,60.96 | 147.32,60.96 R23.P$1 R22.P$1 | C11.2 147.32,60.96
N$42
  Top 0.813: C10.2 R21.P$1 arc-90 IC2.3
N$43  (via drill 0.8)
  Top 0.813: v133.35,60.96 arc90 134.62,62.23 arc-90 135.89,63.5 138.43,63.5 | C11.1 arc-90 146.05,63.5 138.43,63.5 | IC2.6 138.43,63.5
  Bottom 0.813: Q11.2 arc-90 127,60.96 v133.35,60.96
N$46
  Top 0.813: R47.P$2 D7.A
N$47
  Top 0.813: R7.P$2 arc90 43.18,48.26 44.45,48.26 arc90 46.99,50.8 Q1.1
N$48
  Top 0.813: Q11.1 125.73,50.8 arc90 128.27,48.26 129.54,48.26 arc90 R27.P$2
OUT_L
  Top 0.813: J2.T arc-90 63.94,19.05 44.45,19.05 | 44.45,19.05 38.1,19.05 | R20.P$2 44.45,19.05
  Top 1.778: C8.- 38.1,19.05 C9.-
OUT_R  (via drill 0.8)
  Top 0.813: v93.98,5.08 v93.98,7.62 arc90 88.46,13.14 J2.R | R40.P$2 arc-90 143.51,5.08 134.62,5.08 | 134.62,5.08 C17.- | 134.62,5.08 v134.62,3.81
  Top 1.778: C17.- C18.-
  Bottom 0.813: v93.98,7.62 v93.98,5.08 arc90 97.79,1.27 132.08,1.27 arc90 v134.62,3.81 C17.-
PL_L
  Top 0.813: Q5.2 60.96,52.7 arc-90 62.23,53.98 arc90 63.5,55.24 Q4.1 arc-90 67.31,60.96 78.04,60.96 arc90 V1.1
PL_R
  Top 0.813: Q15.2 111.76,52.7 arc90 110.49,53.98 arc-90 109.22,55.24 Q14.1 arc-90 107.95,58.42 arc90 105.41,60.96 96.52,60.96 arc90 90.17,54.61 90.17,48.48 arc90 V1.6
VCC
  Top 0.813: R47.P$1 11.43,6.35 arc90 6.35,11.43 arc-90 2.54,15.24 2.54,40.64
  Top 1.778: Q9.1 4.83,38.35 arc-90 2.54,40.64 2.54,44.45 arc-90 5.08,46.99 6.35,46.99 | IC1.7 C2.2 34.29,71.12 | 135.89,71.12 162.56,71.12 arc-90 166.37,67.31 166.37,64.77 | 135.89,71.12 C12.2 IC2.7 | 166.37,46.99 Q19.1 | R22.P$2 166.37,64.77 | R36.P$2 166.37,46.99 | 166.37,55.88 166.37,64.77 | 166.37,55.88 166.37,46.99 | C16.+ 166.37,55.88 | 6.35,46.99 R16.P$2 | 6.35,55.88 6.35,46.99 | 6.35,64.77 6.35,55.88 | 6.35,64.77 R2.P$2 | C7.+ 6.35,55.88 | 6.35,64.77 6.35,67.31 arc-90 10.16,71.12 34.29,71.12 | 34.29,71.12 arc-90 44.45,81.28 76.2,81.28 | 135.89,71.12 arc90 125.73,81.28 76.2,81.28 | 16.51,119.38 C28.1 | 16.51,119.38 R43.P$1 arc-90 11.43,111.76 IC3.2 5.08,111.76 arc90 2.54,109.22 2.54,101.6 | D4.A 16.51,119.38 | 2.54,101.6 arc90 12.7,91.44 72.39,91.44 arc-90 76.2,87.63 76.2,81.28 | D5.C 2.54,101.6

### Text on the board
tPlace: 30VAC | L | G | R